# EAGLE design Lab_6 (EAGLE 9.6.2)
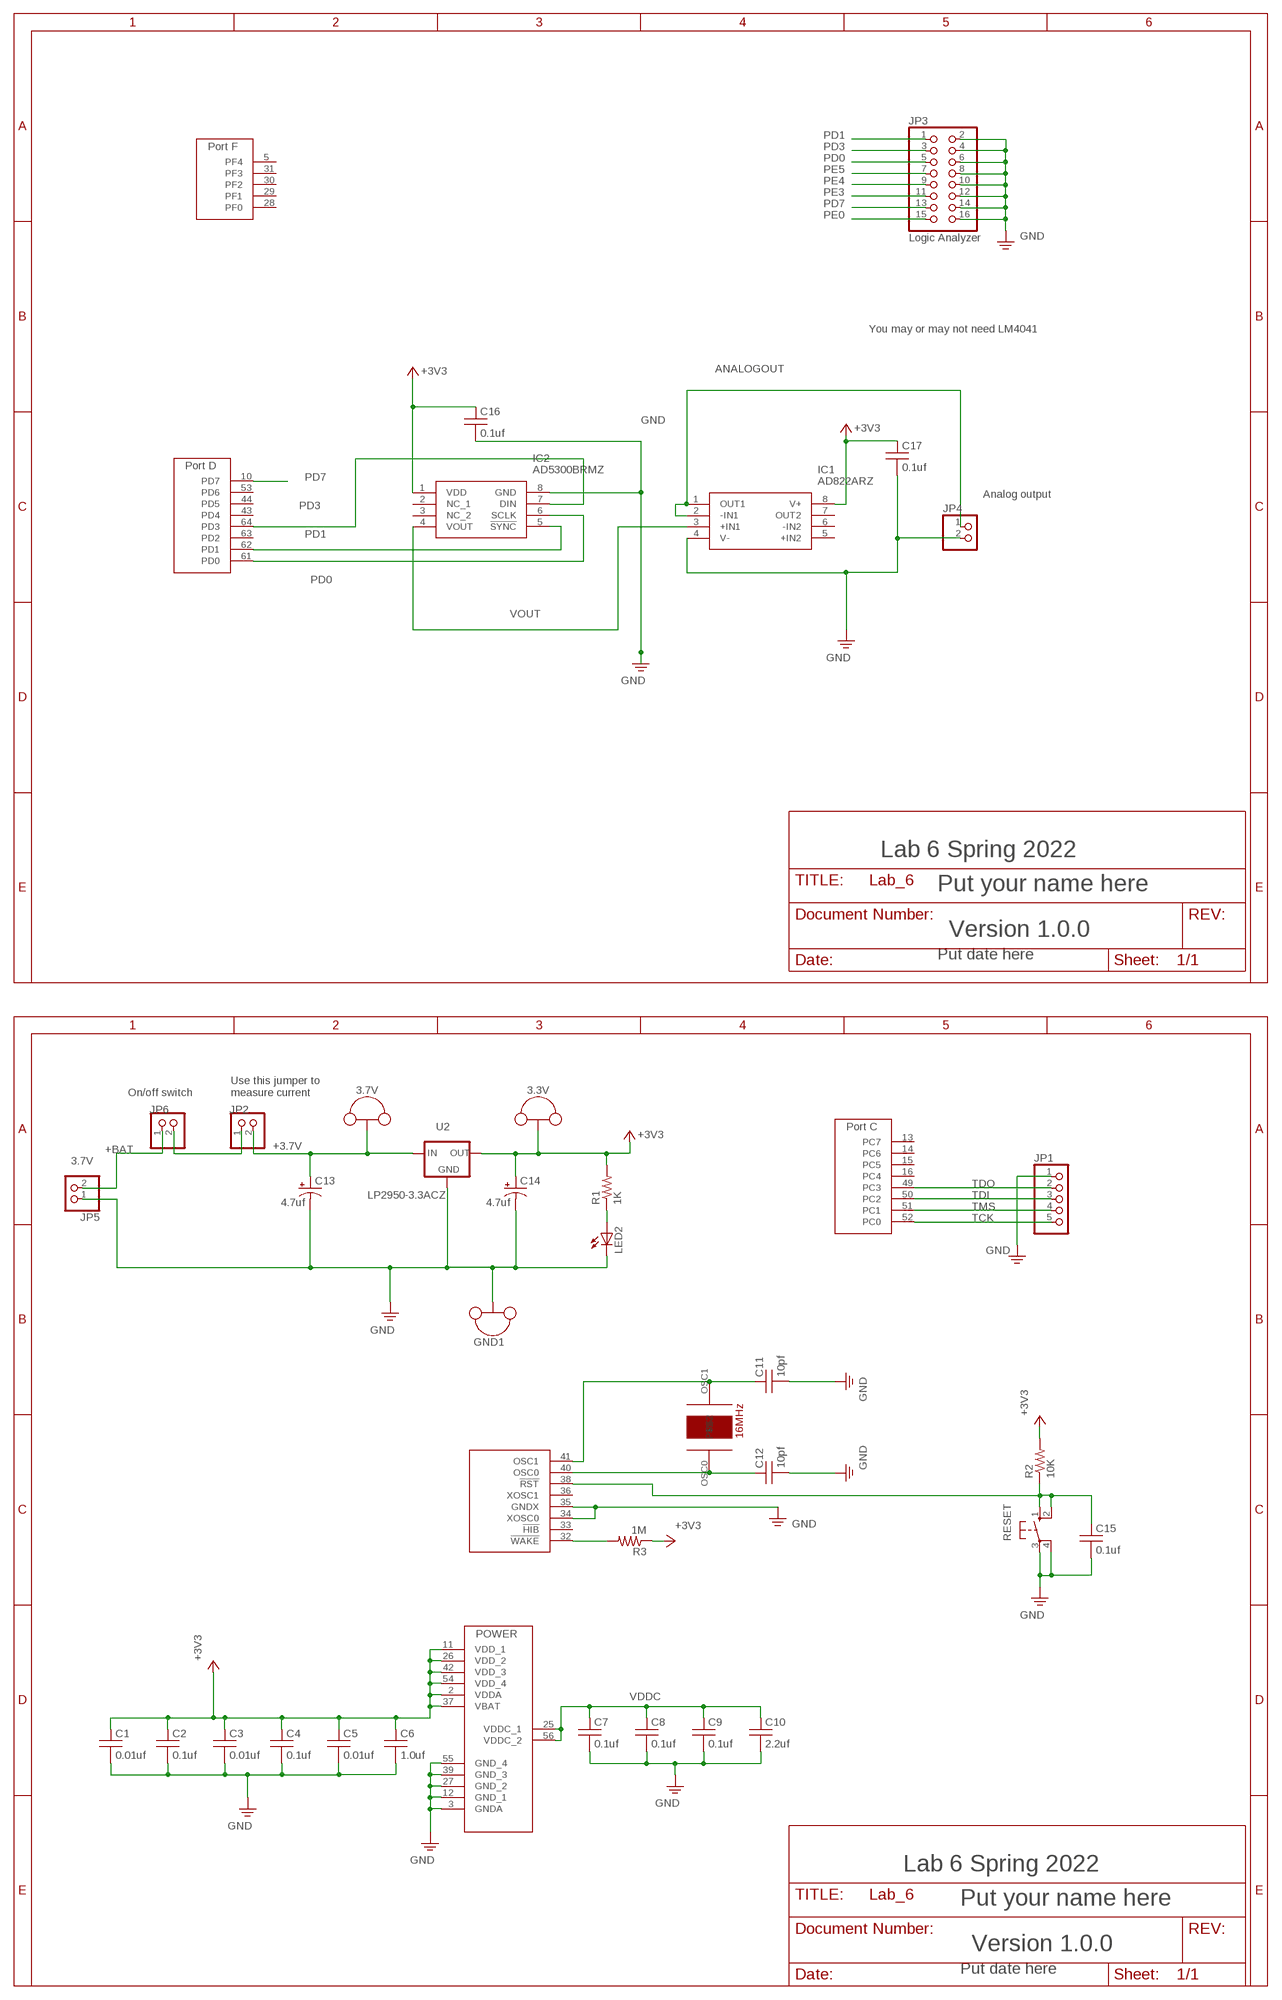
[diagram p0: schematic, sheet 1, part 1 of 2]
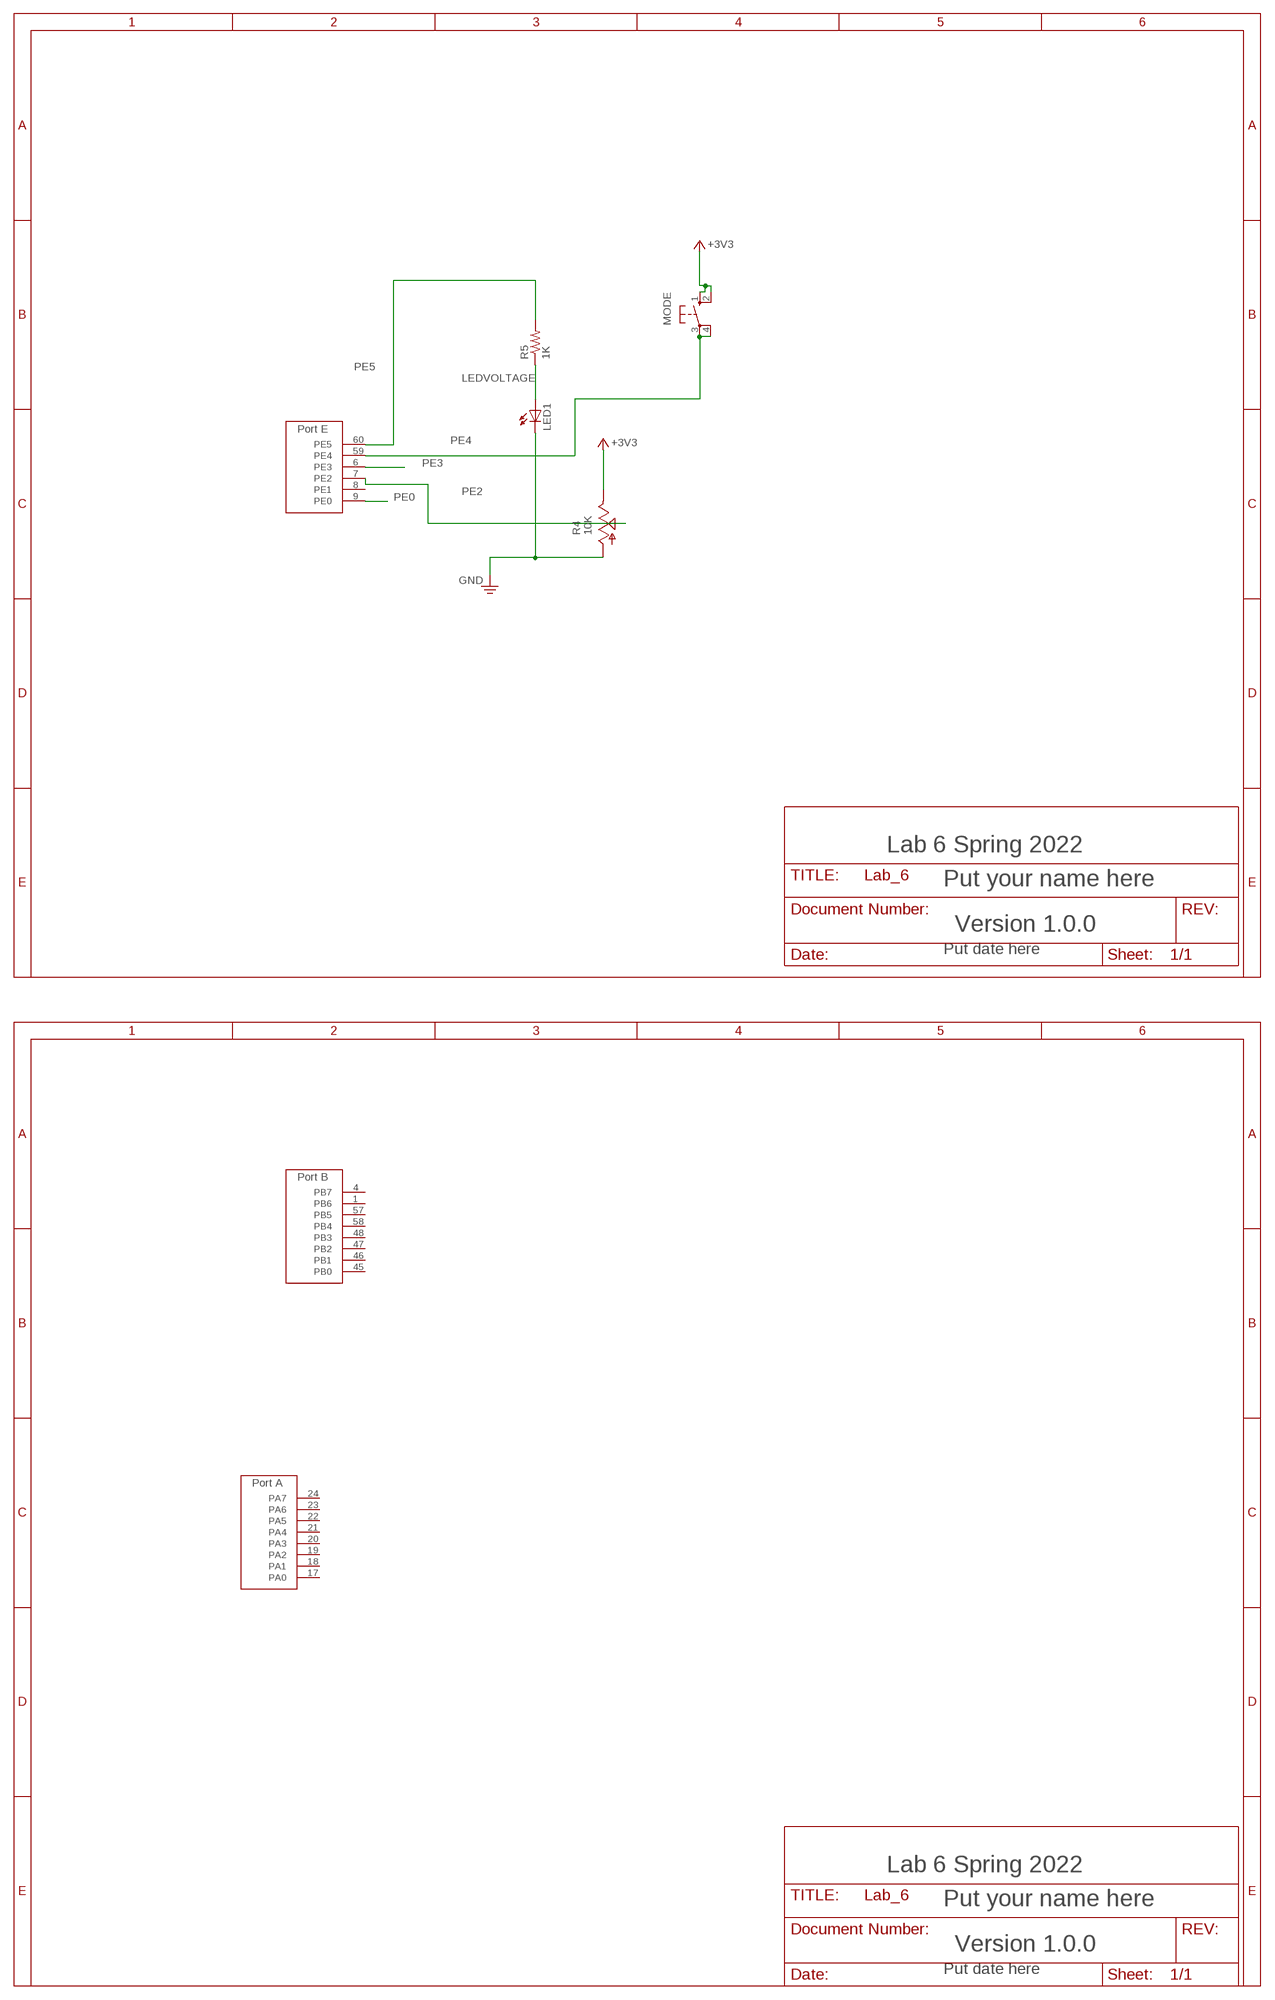
[diagram p1: schematic, sheet 1, part 2 of 2]

## Parts
3.3V  TP_LOOP  [TP_LOOP]
3.7V  TP_LOOP  [TP_LOOP]
C1  0.01uf  CAPACITOR025-024X044  [CAP100MIL]
C2  0.1uf  CAPACITOR025-024X044  [CAP100MIL]
C3  0.01uf  CAPACITOR025-024X044  [CAP100MIL]
C4  0.1uf  CAPACITOR025-024X044  [CAP100MIL]
C5  0.01uf  CAPACITOR025-024X044  [CAP100MIL]
C6  1.0uf  CAPACITOR025-024X044  [CAP100MIL]
C7  0.1uf  CAPACITOR025-024X044  [CAP100MIL]
C8  0.1uf  CAPACITOR025-024X044  [CAP100MIL]
C9  0.1uf  CAPACITOR025-024X044  [CAP100MIL]
C10  2.2uf  CAPACITOR025-024X044  [CAP100MIL]
C11  10pf  CAPACITOR025-024X044  [CAP100MIL]
C12  10pf  CAPACITOR025-024X044  [CAP100MIL]
C13  4.7uf  CAPACITOR_POLARIZEDE5-6  [CAP200MILPOLARIZED]
C14  4.7uf  CAPACITOR_POLARIZEDE5-6  [CAP200MILPOLARIZED]
C15  0.1uf  CAPACITOR025-024X044  [CAP100MIL]
C16  0.1uf  CAPACITOR025-024X044  [CAP100MIL]
C17  0.1uf  CAPACITOR025-024X044  [CAP100MIL]
GND1  TP_LOOP  [TP_LOOP]
IC1  AD822ARZ  [SOIC127P600X175-8N]
IC2  AD5300BRMZ  [SOP65P490X110-8N]
JP1  PINHD-1X5  [1X05]
JP2  PINHD-1X2  [1X02]
JP3  Logic Analyzer  PINHD-2X8  [2X08]
JP4  PINHD-1X2  [1X02]
JP5  PINHD-1X2  [1X02]
JP6  PINHD-1X2  [1X02]
LED1  LED3MM  [LED3MM]
LED2  LED3MM  [LED3MM]
MODE  B3F-1052  [B3F-10XX]
R1  1K  RESISTOR0204/5  [RES200MIL]
R2  10K  RESISTOR0204/5  [RES200MIL]
R3  1M  RESISTOR0204/5  [RES200MIL]
R4  10K  POTENTIOMETER_PTA2043B25U  [PTA2043]
R5  1K  RESISTOR0204/5  [RES200MIL]
RESET  B3F-1052  [B3F-10XX]
U1  TM4C123GH6PM  [QFP50P1200X1200X160-64N]
U2  LP2950-3.3ACZ  [TO92]
Y1  16MHZ_CRYSTAL  [16MHZ_CRYSTAL]

## Nets
+3.7V: 3.7V.P$1(TP) 3.7V.P$2(TP) C13.+ JP2.2 U2.3(IN)
+3V3: 3.3V.P$1(TP) 3.3V.P$2(TP) C1.1 C2.1 C3.1 C4.1 C5.1 C6.1 C14.+ C16.1 C17.1 IC1.8(V+) IC2.1(VDD) MODE.1(S) MODE.2(S1) R1.2 R2.2 R3.1 R4.1(E) U1.2(VDDA) U1.11(VDD_1) U1.26(VDD_2) U1.37(VBAT) U1.42(VDD_3) U1.54(VDD_4) U2.1(OUT)
+BAT: JP5.2 JP6.1
ANALOGOUT: IC1.1(OUT1) IC1.2(-IN1) JP4.1
GND: C1.2 C2.2 C3.2 C4.2 C5.2 C6.2 C7.2 C8.2 C9.2 C10.2 C11.2 C12.2 C13.- C14.- C15.2 C16.2 C17.2 GND1.P$1(TP) GND1.P$2(TP) IC1.4(V-) IC2.8(GND) JP1.1 JP3.2 JP3.4 JP3.6 JP3.8 JP3.10 JP3.12 JP3.14 JP3.16 JP4.2 JP5.1 LED1.K(C) LED2.K(C) R4.3(A) RESET.3(P) RESET.4(P1) U1.3(GNDA) U1.12(GND_1) U1.27(GND_2) U1.34(XOSC0) U1.35(GNDX) U1.39(GND_3) U1.55(GND_4) U2.2(GND)
LEDVOLTAGE: LED1.A R5.1
OSC0: C12.1 U1.40(OSC0) Y1.OSC0
OSC1: C11.1 U1.41(OSC1) Y1.OSC1
PD0: IC2.6(SCLK) JP3.5 U1.61(PD0)
PD1: IC2.5(!SYNC) JP3.1 U1.62(PD1)
PD3: IC2.7(DIN) JP3.3 U1.64(PD3)
PD7: JP3.13 U1.10(PD7)
PE0: JP3.15 U1.9(PE0)
PE2: R4.2(S) U1.7(PE2)
PE3: JP3.11 U1.6(PE3)
PE4: JP3.9 MODE.3(P) MODE.4(P1) U1.59(PE4)
PE5: JP3.7 R5.2 U1.60(PE5)
POWERLED: LED2.A R1.1
RESET: C15.1 R2.1 RESET.1(S) RESET.2(S1) U1.38(!RST)
SWITCHEDPOWER: JP2.1 JP6.2
TCK: JP1.5 U1.52(PC0)
TDI: JP1.3 U1.50(PC2)
TDO: JP1.2 U1.49(PC3)
TMS: JP1.4 U1.51(PC1)
VDDC: C7.1 C8.1 C9.1 C10.1 U1.25(VDDC_1) U1.56(VDDC_2)
VOUT: IC1.3(+IN1) IC2.4(VOUT)
WAKE: R3.2 U1.32(!WAKE)
Unconnected: IC1.5(+IN2) IC1.6(-IN2) IC1.7(OUT2) IC2.2(NC_1) IC2.3(NC_2) U1.1(PB6) U1.4(PB7) U1.5(PF4) U1.8(PE1) U1.13(PC7) U1.14(PC6) U1.15(PC5) U1.16(PC4) U1.17(PA0) U1.18(PA1) U1.19(PA2) U1.20(PA3) U1.21(PA4) U1.22(PA5) U1.23(PA6) U1.24(PA7) U1.28(PF0) U1.29(PF1) U1.30(PF2) U1.31(PF3) U1.33(!HIB) U1.36(XOSC1) U1.43(PD4) U1.44(PD5) U1.45(PB0) U1.46(PB1) U1.47(PB2) U1.48(PB3) U1.53(PD6) U1.57(PB5) U1.58(PB4) U1.63(PD2)

## Notes on the sheet
- You may or may not need LM4041
- Analog output
- Lab 6 Spring 2022
- Lab 6 Spring 2022
- Put your name here
- Put your name here
- Version 1.0.0
- Version 1.0.0
- Put date here
- Put date here
- On/off switch
- Use this jumper to
  measure current
- 3.7V
- Lab 6 Spring 2022 | Lab 6 Spring 2022
- Put your name here | Put your name here
- Version 1.0.0 | Version 1.0.0
- Put date here | Put date here

## Library data of the parts
3.3V 3.7V GND1 = EE445L:TP_LOOP
C1-C12 C15-C17 = EE445L:CAPACITOR: CAPACITOR, American symbol
C13 C14 = EE445L:CAPACITOR_POLARIZED: POLARIZED CAPACITOR, American symbol
IC1 = AD822ARZ:AD822ARZ: Dual low power op amp,AD822AR SO8 Source: Datasheet <https://componentsearchengine.com//AD822ARZ.pdf>; DESCRIPTION: Dual low power op amp,AD822AR SO8; HEIGHT: 1.75mm; MANUFACTURER_NAME: Analog Devices; MANUFACTURER_PART_NUMBER: AD822ARZ; MOUSER2_PART_NUMBER: 584-AD822ARZ; MOUSER2_PRICE-STOCK: https://www.mouser.com/Search/Refine.aspx?Keyword=584-AD822ARZ
IC2 = AD5300BRMZ:AD5300BRMZ: AD5300BRMZ Source: Datasheet <http://www.analog.com/media/en/technical-documentation/data-sheets/AD5300.pdf>; DESCRIPTION: AD5300BRMZ; HEIGHT: 1.1mm; MANUFACTURER_NAME: Analog Devices; MANUFACTURER_PART_NUMBER: AD5300BRMZ; MOUSER_PART_NUMBER: 584-AD5300BRMZ; MOUSER_PRICE-STOCK: https://www.mouser.co.uk/ProductDetail/Analog-Devices/AD5300BRMZ?qs=NmRFExCfTkG3u0CQJ9DUvA%3D%3D
JP1 = EE445L:PINHD-1X5: PIN HEADER
JP2 JP4-JP6 = EE445L:PINHD-1X2: PIN HEADER
JP3 = EE445L:PINHD-2X8: PIN HEADER
LED1 LED2 = EE445L:LED: Avago Technologies LED Green 2mA 5mm diffused, HLMP-4740, Digikey 516-1327-ND Red 1.6V 1mA 5mm diffused, HLMP-D150, Digikey 516-1323-ND Yellow 2mA 5mm diffused, HLMP-4719, Digikey 516-1326-ND Orange 10mA 5mm diffused HLMP-D401, Digikey 516-1330-ND Blue 10mA 5mm diffused
MODE RESET = EE445L:B3F-1052: OMRON SWITCH 1.1mm holes; MPN: B3F-1000; OC_FARNELL: 176432; OC_NEWARK: 36M3542
R1-R3 R5 = EE445L:RESISTOR: RESISTOR, American symbol
R4 = EE445L:POTENTIOMETER_PTA2043: POTENTIOMETER Warning There are many many sizes and shapes of potentiometers. Please verify both the wiring and the physical layout of your pots.
U1 = EE445L:TM4C123GH6PM
U2 = EE445L:LP2950: LP2950 3.3V regulator, 100 mA TO-92 On Semiconductor LP2950ACZ-3.3G, Mouser 863-LP2950ACZ-3.3G
Y1 = EE445L:16MHZ_CRYSTAL

## Board
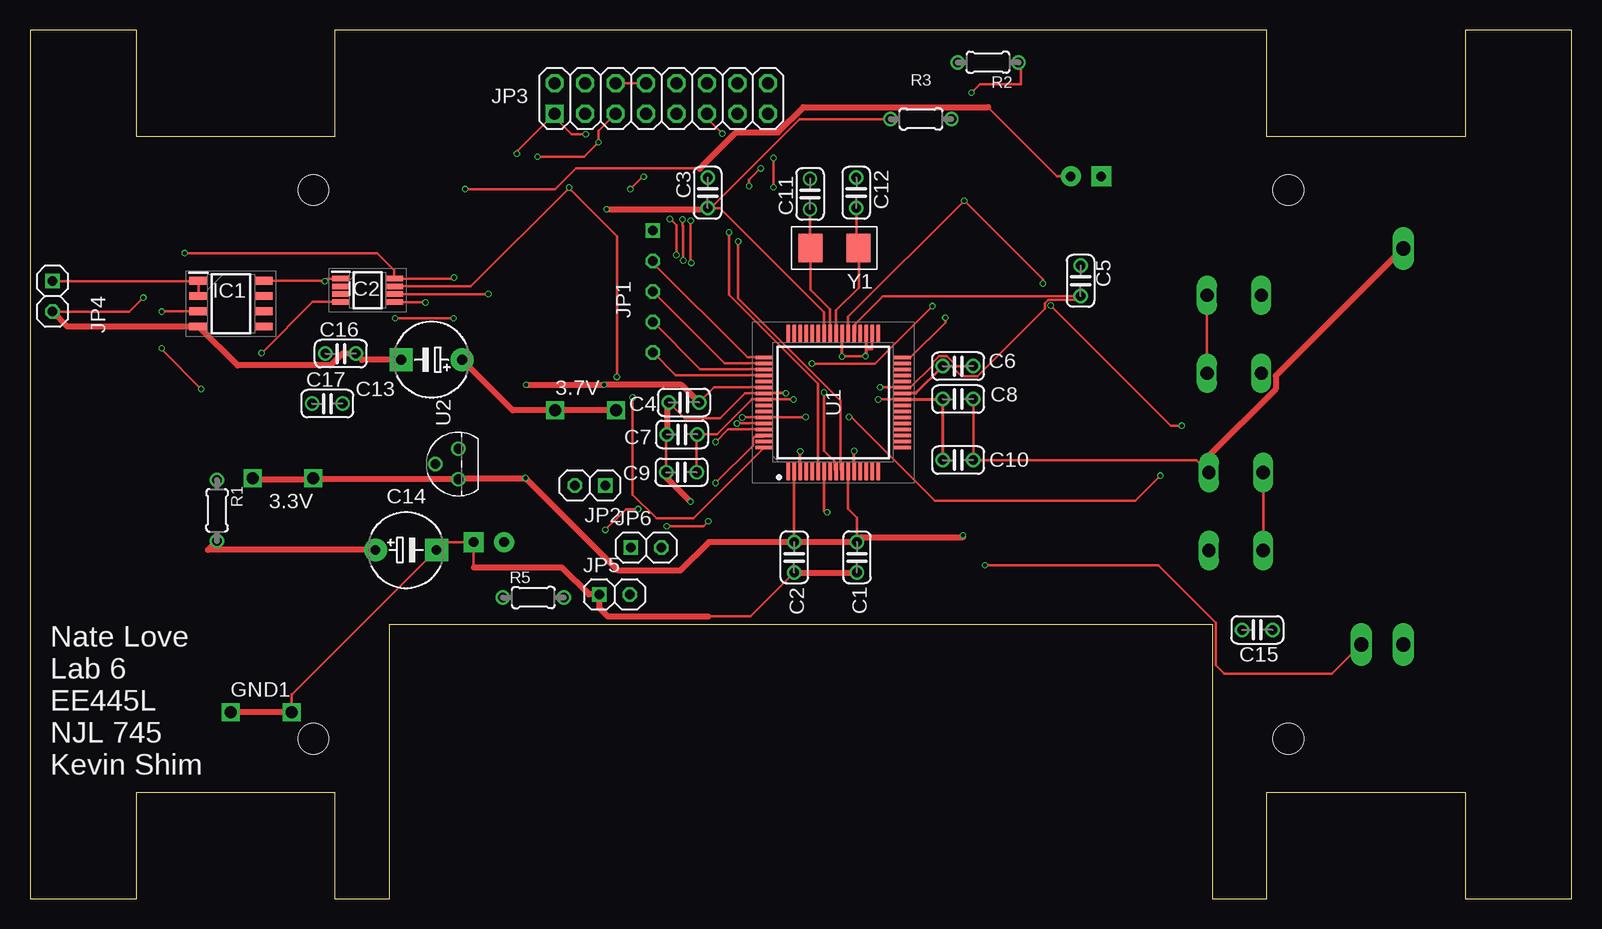
[diagram p2: board, top side]
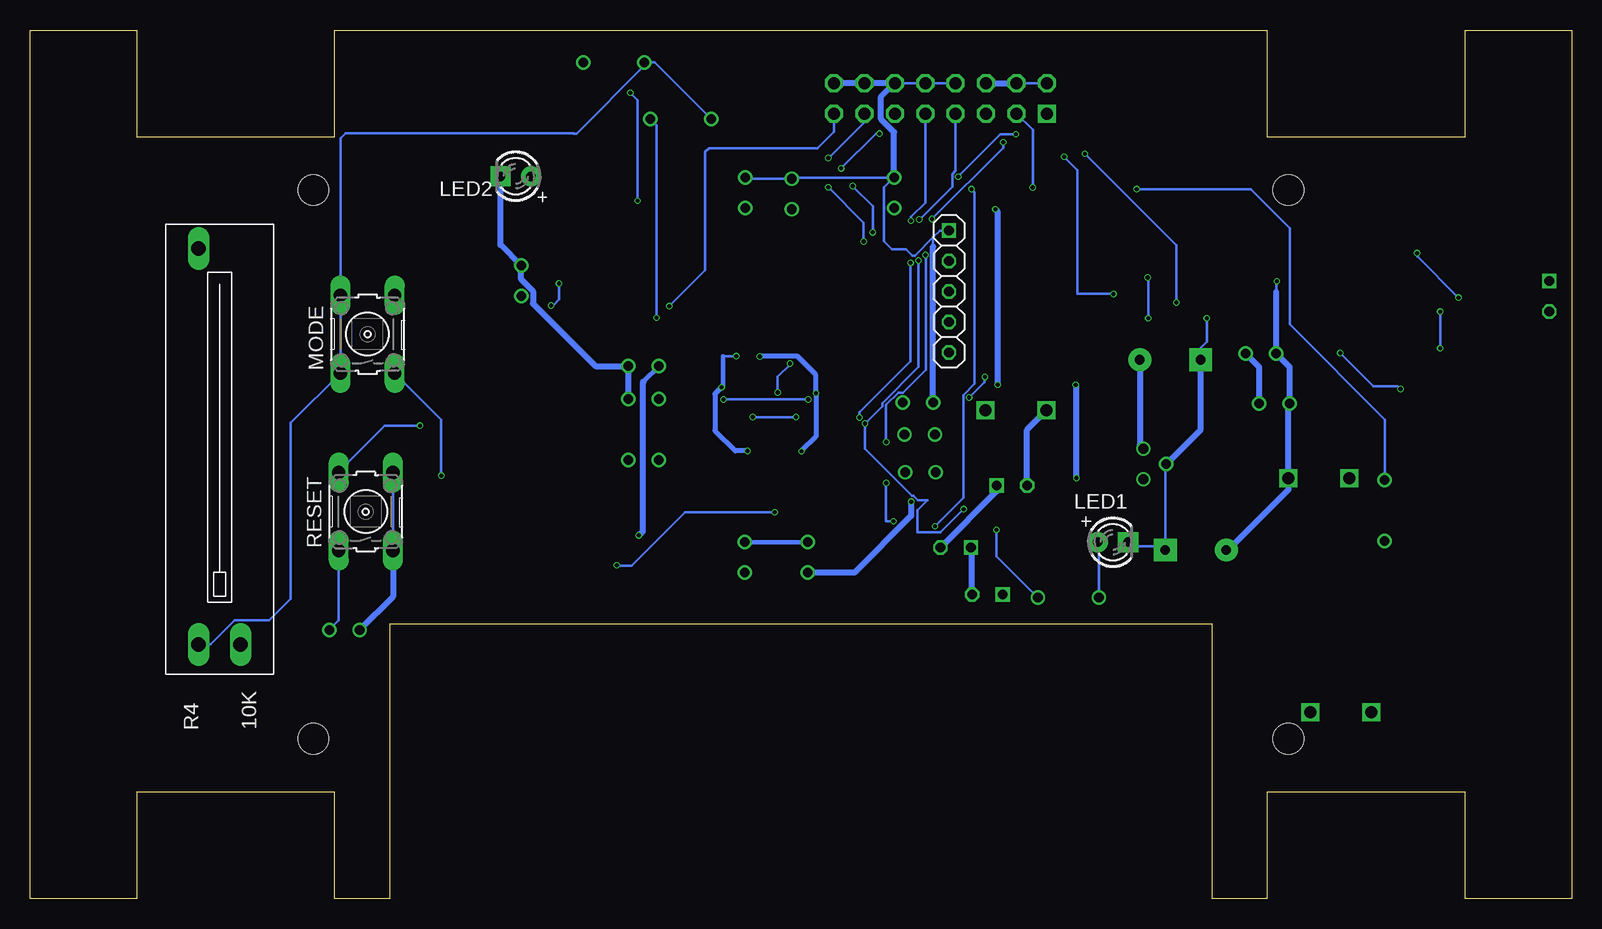
[diagram p3: board, bottom side, seen from below]

Size 128.52 x 72.39 mm. Coordinates in mm from the lower left corner, seen from the top.
Outline: 0,0 8.89,0 8.89,8.89 25.4,8.89 25.4,0 29.97,0 29.97,22.86 98.55,22.86 98.55,0 103.12,0 103.12,8.89 119.63,8.89 119.63,0 128.52,0 128.52,72.39 119.63,72.39 119.63,63.5 103.12,63.5 103.12,72.39 25.4,72.39 25.4,63.5 8.89,63.5 8.89,72.39 0,72.39 0,0
Copper layers (1*16): Top 0.035559375mm / dielectric 1.6mm / Bottom 0.035559375mm
Design rules "jlcpcb2layer": minimum track width 5mil, minimum drill 12mil, track to track 5mil, track to pad 5mil, pad to pad 5mil, via to via 5mil, smd to smd 5mil, copper to edge 8mil, drill to drill 6mil, minimum pad ring 5mil, minimum via ring 3mil, stop-mask expansion 2.5mil, vias tented up to drill 0mil, thermal gap 10mil
Holes 2.54 mm at 23.62,13.34 104.9,13.34 104.9,59.05 23.62,59.05

### Footprints (pad centres in the part's own frame; a part is rotated, then mirrored left to right if it is on the bottom)
TP_LOOP = drill 1 square: P$1 0,0; P$2 5.08,0
CAP100MIL = drill 0.8: 1 -1.27,0; 2 1.27,0
CAP200MILPOLARIZED = drill 0.8 pad 1.905: + -2.54,0 | drill 0.8 pad 1.905 square: - 2.54,0
SOIC127P600X175-8N = smd 1.525 x 0.65: 1 -2.712,1.905; 2 -2.712,0.635; 3 -2.712,-0.635; 4 -2.712,-1.905; 5 2.712,-1.905; 6 2.712,-0.635; 7 2.712,0.635; 8 2.712,1.905
SOP65P490X110-8N = smd 1.45 x 0.45: 1 -2.225,0.975; 2 -2.225,0.325; 3 -2.225,-0.325; 4 -2.225,-0.975; 5 2.225,-0.975; 6 2.225,-0.325; 7 2.225,0.325; 8 2.225,0.975
1X05 = drill 0.8 square: 1 -5.08,0 | drill 0.8 octagon: 2 -2.54,0; 3 0,0; 4 2.54,0; 5 5.08,0
1X02 = drill 0.8 square: 1 -1.27,0 | drill 0.8 octagon: 2 1.27,0
2X08 = drill 1 square: 1 -8.89,-1.27 | drill 1 octagon: 2 -8.89,1.27; 3 -6.35,-1.27; 4 -6.35,1.27; 5 -3.81,-1.27; 6 -3.81,1.27; 7 -1.27,-1.27; 8 -1.27,1.27; 9 1.27,-1.27; 10 1.27,1.27; 11 3.81,-1.27; 12 3.81,1.27; 13 6.35,-1.27; 14 6.35,1.27; 15 8.89,-1.27; 16 8.89,1.27
LED3MM = drill 0.8 pad 1.676: A -1.27,0 | drill 0.8 pad 1.676 square: K 1.27,0
B3F-10XX = drill 1.1 long: 1 -3.251,2.261; 2 3.251,2.261; 3 -3.251,-2.261; 4 3.251,-2.261
RES200MIL = drill 0.8: 1 -2.54,0; 2 2.54,0
PTA2043 = drill 1.194 long: 1 -13,1.75; 2 -13,-1.75; 3 20,1.75
QFP50P1200X1200X160-64N = smd 1.475 x 0.3: 1 -5.738,3.75; 2 -5.738,3.25; 3 -5.738,2.75; 4 -5.738,2.25; 5 -5.738,1.75; 6 -5.738,1.25; 7 -5.738,0.75; 8 -5.738,0.25; 9 -5.738,-0.25; 10 -5.738,-0.75; 11 -5.738,-1.25; 12 -5.738,-1.75; 13 -5.738,-2.25; 14 -5.738,-2.75; 15 -5.738,-3.25; 16 -5.738,-3.75; 33 5.738,-3.75; 34 5.738,-3.25; 35 5.738,-2.75; 36 5.738,-2.25; 37 5.738,-1.75; 38 5.738,-1.25; 39 5.738,-0.75; 40 5.738,-0.25; 41 5.738,0.25; 42 5.738,0.75; 43 5.738,1.25; 44 5.738,1.75; 45 5.738,2.25; 46 5.738,2.75; 47 5.738,3.25; 48 5.738,3.75 | smd 0.3 x 1.475: 17 -3.75,-5.738; 18 -3.25,-5.738; 19 -2.75,-5.738; 20 -2.25,-5.738; 21 -1.75,-5.738; 22 -1.25,-5.738; 23 -0.75,-5.738; 24 -0.25,-5.738; 25 0.25,-5.738; 26 0.75,-5.738; 27 1.25,-5.738; 28 1.75,-5.738; 29 2.25,-5.738; 30 2.75,-5.738; 31 3.25,-5.738; 32 3.75,-5.738; 49 3.75,5.738; 50 3.25,5.738; 51 2.75,5.738; 52 2.25,5.738; 53 1.75,5.738; 54 1.25,5.738; 55 0.75,5.738; 56 0.25,5.738; 57 -0.25,5.738; 58 -0.75,5.738; 59 -1.25,5.738; 60 -1.75,5.738; 61 -2.25,5.738; 62 -2.75,5.738; 63 -3.25,5.738; 64 -3.75,5.738
TO92 = drill 0.8: 1 -1.27,0; 2 0,1.905; 3 1.27,0
16MHZ_CRYSTAL = smd 2 x 2.4: OSC0 1,1.27; OSC1 5,1.27

### Placement (x,y rotation side)
3.3V  23.62,35.05 180 top
3.7V  43.79,40.69 0 top
C1  68.94,28.45 270 top
C2  63.7,28.45 270 top
C3  56.49,58.83 90 top
C4  54.51,41.35 180 top
C5  87.58,51.49 90 top
C6  77.37,44.37 0 top
C7  54.36,38.68 180 top
C8  77.37,41.63 0 top
C9  54.31,35.53 180 top
C10  77.37,36.55 0 top
C11  65.02,58.72 90 top
C12  68.88,58.83 90 top
C13  33.48,44.91 180 top
C14  31.34,29.06 0 top
C15  102.31,22.4 180 top
C16  25.91,45.42 0 top
C17  24.79,41.25 0 top
GND1  16.71,15.54 0 top
IC1  16.76,49.58 0 top
IC2  28.14,50.7 0 top
JP1  51.92,50.6 270 bottom
JP2  46.69,34.44 180 top
JP3  52.63,66.7 0 top
JP4  1.88,50.19 270 top
JP5  48.72,25.35 0 top
JP6  51.36,29.26 0 top
LED1  38.25,29.72 0 bottom
LED2  88.04,60.2 180 bottom
MODE  100.38,47.04 90 bottom
R1  15.6,32.36 270 top
R2  79.86,69.7 180 top
R3  74.27,64.97 0 top
R4  112.73,34.19 90 bottom
R5  41.96,25.1 0 top
RESET  100.53,32.26 90 bottom
U1  66.95,41.35 90 top
U2  35.71,36.22 90 top
Y1  70.08,55.5 180 top

### Tracks (layer width: path | path; a pad name or v marks a point on that pad's centre or on a via)
+3.7V
  Top 0.508: 3.7V.P$2 3.7V.P$1 40.23,40.69 C13.+
  Bottom 0.508: C13.+ 36.02,37.8 U2.3 | 3.7V.P$1 45.41,39.06 JP2.2
+3V3  (via drill 0.35)
  Top 0.203: U1.2 63.7,29.77 C2.1 | U1.11 68.2,32.48 68.94,31.75 C1.1 | U1.54 57.03,42.6 C4.1 | 56.74,57.56 57.51,57.56 66.2,48.86 U1.42 | 56.74,57.56 56.54,57.56 C3.1 | U1.37 68.83,47.21 68.83,47.92 71.12,50.22 C5.1 87.28,49.92 84.89,49.92 84.6,49.63 84.6,49.16 78.98,43.55 77.63,43.55 76.8,44.37 C6.1 | 56.74,57.56 64.16,64.97 R3.1 | IC2.1 24.8,51.67 v24.59,51.46 24.56,51.49 IC1.8 19.5,51.46
  Top 0.254: C6.1 73.83,42.1 U1.26
  Top 0.508: 3.3V.P$2 18.69,34.9 23.47,34.9 3.3V.P$1 23.72,34.95 U2.1 35.81,35.05 v41.3,35.05 49.02,27.33 54.2,27.33 56.59,29.72 C2.1 | C14.+ 14.83,29.06 R1.2 | v41.35,42.82 v47.85,42.82 54.3,42.82 C4.1 | 63.7,29.77 63.76,29.72 C1.1 69.34,30.12 77.78,30.12 v77.78,30.28 | v48.06,57.45 56.44,57.45 56.54,57.56
  Bottom 0.203: R3.1 76.45,69.7 R2.2 77.32,69.39 82.96,63.75 83.21,63.75 83.21,63.8 102.21,63.8 102.64,63.37 MODE.2 MODE.1 106.78,39.65 106.78,24.99 108.57,23.21 111.44,23.21 113.46,21.19 R4.1 | 24.64,50.55 24.64,51.41 v24.59,51.46
  Bottom 0.381: C2.1 C1.1 | 77.37,43.1 C6.1
  Bottom 0.508: C14.+ 28.75,28.96 23.62,34.09 3.3V.P$1 23.62,41.15 C17.1 23.52,44.3 C16.1 24.64,50.55 | v41.3,35.05 41.3,42.77 v41.35,42.82 | v77.78,30.28 77.45,30.6 77.45,43.02 77.37,43.1 | v47.85,42.82 47.85,57.25 v48.06,57.45
+BAT
  Bottom 0.508: JP5.2 49.99,29.16 JP6.1
ANALOGOUT
  Top 0.203: JP4.1 14.03,51.46 IC1.1 IC1.2
GND  (via drill 0.35)
  Top 0.203: 67.69,47.08 U1.39 | v70.87,42.62 70.89,42.6 U1.27 73.4,42.6 75.27,44.47 75.27,44.72 75.75,45.2 76.44,45.2 77.27,44.37 C6.2 | v63.01,42.12 62.99,42.1 | v68.7,37.31 v68.71,37.31 | U1.34 70.2,45.77 69.7,45.77 | RESET.4 97.23,36.55 C10.2 C8.2 | v30.43,48.36 v35.31,48.36 | JP4.2 8.28,48.92 v9.45,50.09 | v12.9,53.8 28.96,53.8 30.37,52.38 IC2.8 35.27,51.67 v35.36,51.77 | C4.2 54.56,40.03 57.51,40.03 59.59,42.11 61.2,42.11 U1.55 | v67.69,45.19 69.62,45.19 v69.65,45.21 | 56.54,23.52 60.05,23.52 C2.2 | JP3.8 JP3.6 | 36.98,27.58 LED1.K | LED1.K 36.47,29.21 | LED1.K 34.54,29.72 C14.- 21.84,17.02 21.79,17.02 GND1.P$2 | 53.03,35.12 C9.2 53.03,38.63
  Top 0.254: v67.69,45.19 67.69,47.08 | U1.3 v64.2,37.29 | 62.99,42.1 U1.55 | U1.12 v68.7,37.31 | U1.35 69.7,45.77 69.7,45.27 v69.65,45.21
  Top 0.508: 36.98,27.58 44.35,27.58 46.58,25.35 JP5.1 47.45,24.23 48.16,23.52 56.54,23.52 | 53.03,35.12 v55.07,33.09 | 53.03,38.63 C7.2 53.09,41.2 C4.2 | GND1.P$2 GND1.P$1 | C13.- 27.69,44.91 C16.2 26.02,45.41 25.04,44.43 17.29,44.43 IC1.4 3.12,47.68 JP4.2 | R4.3 103.85,43.56 103.85,42.47 98.27,36.89 RESET.4 | C2.2 C1.2
  Bottom 0.203: v64.2,37.29 64.2,37.31 | 53.24,55.12 52.68,55.68 JP1.1 | 53.24,55.12 54.76,53.59 54.96,53.59 55.49,54.13 56.67,54.13 57.32,54.78 57.32,59.27 C3.2 64.92,60.1 C11.2 68.78,59.99 C12.2 | v30.43,48.36 30.43,46.43 30.94,45.92 C13.- | v35.31,48.36 35.31,51.71 v35.36,51.77 | v9.45,50.09 12.85,53.49 12.85,53.8 v12.9,53.8 | JP3.14 JP3.16 | v69.65,45.21 70.74,45.21 70.76,45.19 | 48.87,67.97 JP3.6 JP3.2 JP3.4 | RESET.3 RESET.4 | JP3.8 JP3.10 JP3.12 | 53.24,54.36 53.24,55.12 | 33.88,36.14 C14.- 34.19,29.36 36.63,29.36 | LED1.K 36.63,29.36 | 36.63,29.36 36.47,29.21
  Bottom 0.381: v70.87,42.62 70.76,42.72 70.76,45.19
  Bottom 0.406: 64.2,37.31 63.01,38.51 v63.01,42.12 63.01,43.66 64.54,45.19 v67.69,45.19 | v70.87,42.62 71.42,42.06 71.42,39.01 69.72,37.31 v68.71,37.31
  Bottom 0.508: 33.88,36.14 U2.2 30.94,39.09 C13.- | C17.2 26.06,44.3 C16.2 | LED2.K 89.31,54.48 C5.2 87.58,51.6 86.6,50.62 86.6,49.59 81.38,44.37 C6.2 C8.2 | RESET.3 98.27,25.17 C15.2 | C2.2 59.79,27.18 55.07,31.9 v55.07,33.09 | C4.2 53.24,54.36 | C3.2 56.49,63.88 57.57,64.96 57.57,66.84 JP3.12 JP3.16 | 48.87,67.97 JP3.4
LEDVOLTAGE
  Bottom 0.203: R5.1 39.42,29.62 LED1.A
OSC0
  Top 0.203: U1.40 67.2,49.02 69.09,50.9 Y1.OSC0 68.89,54.42 C12.1
OSC1
  Top 0.203: U1.41 66.7,49.12 65.08,50.75 Y1.OSC1 65.02,54.28 C11.1
PD0  (via drill 0.35)
  Top 0.203: U1.61 58.2,39.1 v57.15,38.05 | v53.88,53.65 53.88,56.1 v53.34,56.64 | JP3.5 47.4,64.01 v47.4,63.04 46.18,61.82 v42.32,61.82 | IC2.6 38.18,50.37 v38.2,50.39
  Bottom 0.203: v57.15,38.05 57.15,41.15 56.12,42.18 55.76,42.18 53.85,44.09 53.85,53.61 v53.88,53.65 | v53.34,56.64 47.4,62.59 v47.4,63.04 | v42.32,61.82 41.2,60.71 41.2,50.39 v38.2,50.39
PD1  (via drill 0.35)
  Top 0.203: U1.62 61.09,38.48 60.38,38.48 60.25,38.35 60.25,37.75 v57.15,34.65 | v56.54,31.45 56.13,31.04 v53.09,31.04 | v50.04,59.13 51.07,60.16 v51.16,60.16 | v46.33,63.7 45.16,63.7 43.74,65.13 JP3.1 40.64,62.33 40.64,62.08 v40.59,62.08 | v32.97,49.68 30.41,49.68 IC2.5
  Bottom 0.203: v57.15,34.65 57.15,31.45 v56.54,31.45 | v53.09,31.04 50.73,33.39 50.73,41.96 49.78,42.91 49.78,58.88 v50.04,59.13 | v46.33,63.7 47.62,63.7 v51.16,60.16 | v40.59,62.08 32.97,54.46 v32.97,49.68
PD3  (via drill 0.35)
  Top 0.203: v48.92,43.48 48.92,55.22 44.93,59.21 | 44.93,59.21 44.91,59.23 v44.93,59.26 | IC2.7 36.75,51.02 44.93,59.21 | U1.64 55.31,31.7 52.22,31.7 50.24,33.68 v50.24,41.76
  Bottom 0.203: v48.92,43.48 48.97,43.43 48.97,43.03 v50.24,41.76 | v44.93,59.26 44.93,64.08 JP3.3
PD7  (via drill 0.35)
  Top 0.203: U1.10 67.58,35.73 67.58,41.49 59.03,50.05 v59.03,54.76 | v61.98,59.28 v61.98,61.72
  Bottom 0.203: v59.03,54.76 59.03,56.34 v61.98,59.28 | v61.98,61.72 58.98,64.72 JP3.13
PE0  (via drill 0.35)
  Top 0.203: U1.9 67.08,35.73 67.08,36.45 66.19,37.33 v66.19,42.19 | v65.18,44.59 70.45,44.59 v75.23,49.38
  Bottom 0.203: v66.19,42.19 66.19,43.48 65.13,44.55 65.17,44.59 v65.18,44.59 | v75.23,49.38 72.24,52.38 72.24,62.23 71.93,62.53 62.89,62.53 61.52,63.91 JP3.15
PE2  (via drill 0.35)
  Top 0.203: U1.7 66.2,32.35 66.34,32.21 v66.45,32.21 | v79.6,27.79 94.06,27.79 98.86,22.99 98.86,19.46 99.57,18.75 108.53,18.75 R4.2
  Bottom 0.203: v66.45,32.21 73.91,32.21 78.38,27.74 79.55,27.74 v79.6,27.79
PE3  (via drill 0.35)
  Top 0.203: U1.6 65.7,42.91 58.27,50.34 v58.27,55.52 | v59.94,59.38 59.94,59.89 v60.91,60.86 | v57.71,63.75 56.44,65.02 JP3.11
  Bottom 0.203: v58.27,55.52 58.27,57.71 v59.94,59.38 | v60.91,60.86 58.01,63.75 v57.71,63.75
PE4  (via drill 0.35)
  Top 0.203: v64.67,40.13 64.64,40.1 U1.59 v59.39,40.1 v59.38,40.09 | v68.28,40.13 68.48,40.13 75.44,33.17 92.15,33.17 v94.23,35.26 | v55.12,52.98 55.07,53.03 55.07,56.5 v55.08,56.5 | MODE.4 MODE.3
  Bottom 0.203: v64.67,40.13 68.17,40.13 68.22,40.08 v68.28,40.13 | v94.23,35.26 94.23,39.9 MODE.3 | v59.38,40.09 59.38,40.54 55.12,44.81 v55.12,52.98 | v55.08,56.5 55.08,56.81 53.9,57.99 JP3.9
PE5  (via drill 0.35)
  Top 0.203: U1.60 v58.94,39.6 v58.93,39.59 | v54.46,53.19 54.46,56.08 54.4,56.13 v54.4,56.59 | v47.95,30.73 49.68,32.46 v50.7,32.46
  Bottom 0.203: v54.46,53.19 54.46,44.31 57.48,41.29 57.48,41.04 v58.93,39.59 58.93,37.49 55.02,33.58 54.86,33.58 54.51,33.22 53.7,33.22 54.56,32.36 54.56,30.53 52.63,30.53 v50.7,32.46 | JP3.7 51.36,60.66 51.65,60.37 51.65,59.34 v54.4,56.59 | R5.2 47.95,28.55 v47.95,30.73
POWERLED  (via drill 0.35)
  Top 0.203: LED2.A 85.61,60.2 79.86,65.95 | v36.27,59.13 43.79,59.13 45.52,60.86 55.76,60.86 55.81,60.81
  Top 0.508: 55.81,60.81 58.86,63.86 62.36,63.86 64.46,65.95 79.86,65.95
  Bottom 0.203: R1.1 15.6,39.93 23.52,47.85 23.52,55.88 26.77,59.13 v36.27,59.13
RESET  (via drill 0.35)
  Top 0.203: U1.38 68.2,48.49 v77.88,58.17 84.43,51.61 v84.43,51.26 | v78.49,67.16 79.2,67.87 82.6,67.87 82.6,69.49 R2.1 | v85.09,49.43 95.1,39.42 v96.01,39.42 | RESET.2 RESET.1
  Bottom 0.203: v77.88,58.17 77.88,66.55 v78.49,67.16 | v84.43,51.26 84.43,49.94 84.94,49.43 v85.09,49.43 | v96.01,39.42 98.96,39.42 102.79,35.59 RESET.2 | C15.1 102.79,23.19 RESET.1
SWITCHEDPOWER
  Bottom 0.508: JP6.2 47.95,33.93 JP2.1
TCK
  Top 0.203: U1.52 53.83,43.6 JP1.5
TDI
  Top 0.203: U1.50 57.91,44.6 JP1.3
TDO
  Top 0.203: U1.49 59.79,45.1 51.76,53.14 JP1.2
TMS
  Top 0.203: U1.51 55.87,44.1 JP1.4
VDDC  (via drill 0.35)
  Top 0.203: 76.09,41.6 C8.1 | C9.1 55.58,38.63 C7.1 57.28,38.68 60.2,41.6 U1.56 v63.65,41.6 | U1.25 v70.72,41.6 v70.71,41.6
  Top 0.254: U1.25 76.09,41.6 | C10.1 C8.1
  Bottom 0.203: v63.65,41.6 v70.71,41.6
VOUT  (via drill 0.35)
  Top 0.203: IC2.4 23.56,49.72 v19.3,45.47 | v14.28,42.47 10.97,45.77 v10.97,45.87 | v10.97,48.92 11,48.95 IC1.3
  Bottom 0.203: v19.3,45.47 16.56,42.72 14.53,42.72 v14.28,42.47 | v10.97,45.87 v10.97,48.92
WAKE  (via drill 0.35)
  Top 0.203: U1.32 73.4,45.1 76.3,48.01 v76.3,48.41
  Bottom 0.203: v76.3,48.41 76.3,64.47 R3.2

### Text on the board
tPlace: Nate Love / Lab 6 / EE445L / NJL 745 / Kevin Shim